# Altium schematic sheet HealthSensors.SchDoc
size A
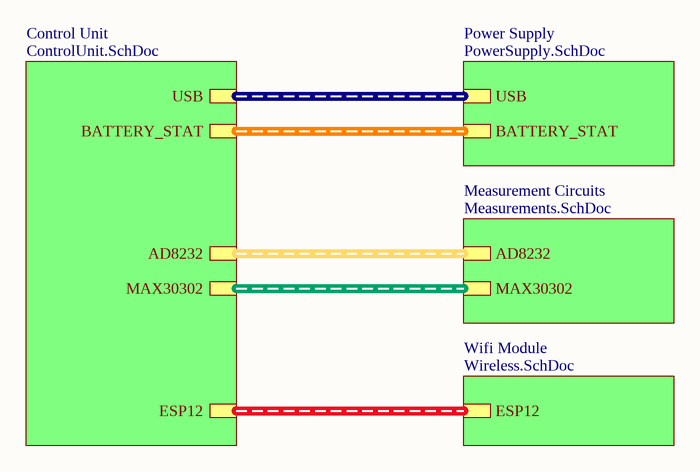
[diagram p0: HealthSensors.SchDoc]

## Sub-sheets
Control Unit = ControlUnit.SchDoc: USB (harness Usb data), BATTERY_STAT (harness Battery info), ESP12 (harness Wifi connection), MAX30302 (harness MAX30302 circuit), AD8232 (harness AD8232 circuit)
Measurement Circuits = Measurements.SchDoc: MAX30302 (harness MAX30302 circuit), AD8232 (harness AD8232 circuit)
Power Supply = PowerSupply.SchDoc: USB (harness Usb data), BATTERY_STAT (harness Battery info)
Wifi Module = Wireless.SchDoc: ESP12 (harness Wifi connection)

## Buses and harness runs
harness sheet Control Unit/AD8232 = sheet Measurement Circuits/AD8232
harness sheet Control Unit/BATTERY_STAT = sheet Power Supply/BATTERY_STAT
harness sheet Control Unit/ESP12 = sheet Wifi Module/ESP12
harness sheet Control Unit/MAX30302 = sheet Measurement Circuits/MAX30302
harness sheet Control Unit/USB = sheet Power Supply/USB